# Altium schematic sheet llrf_afe_front_panel.SchDoc
size 209 x 297 mm; SheetNumber: 6; SheetTotal: 17
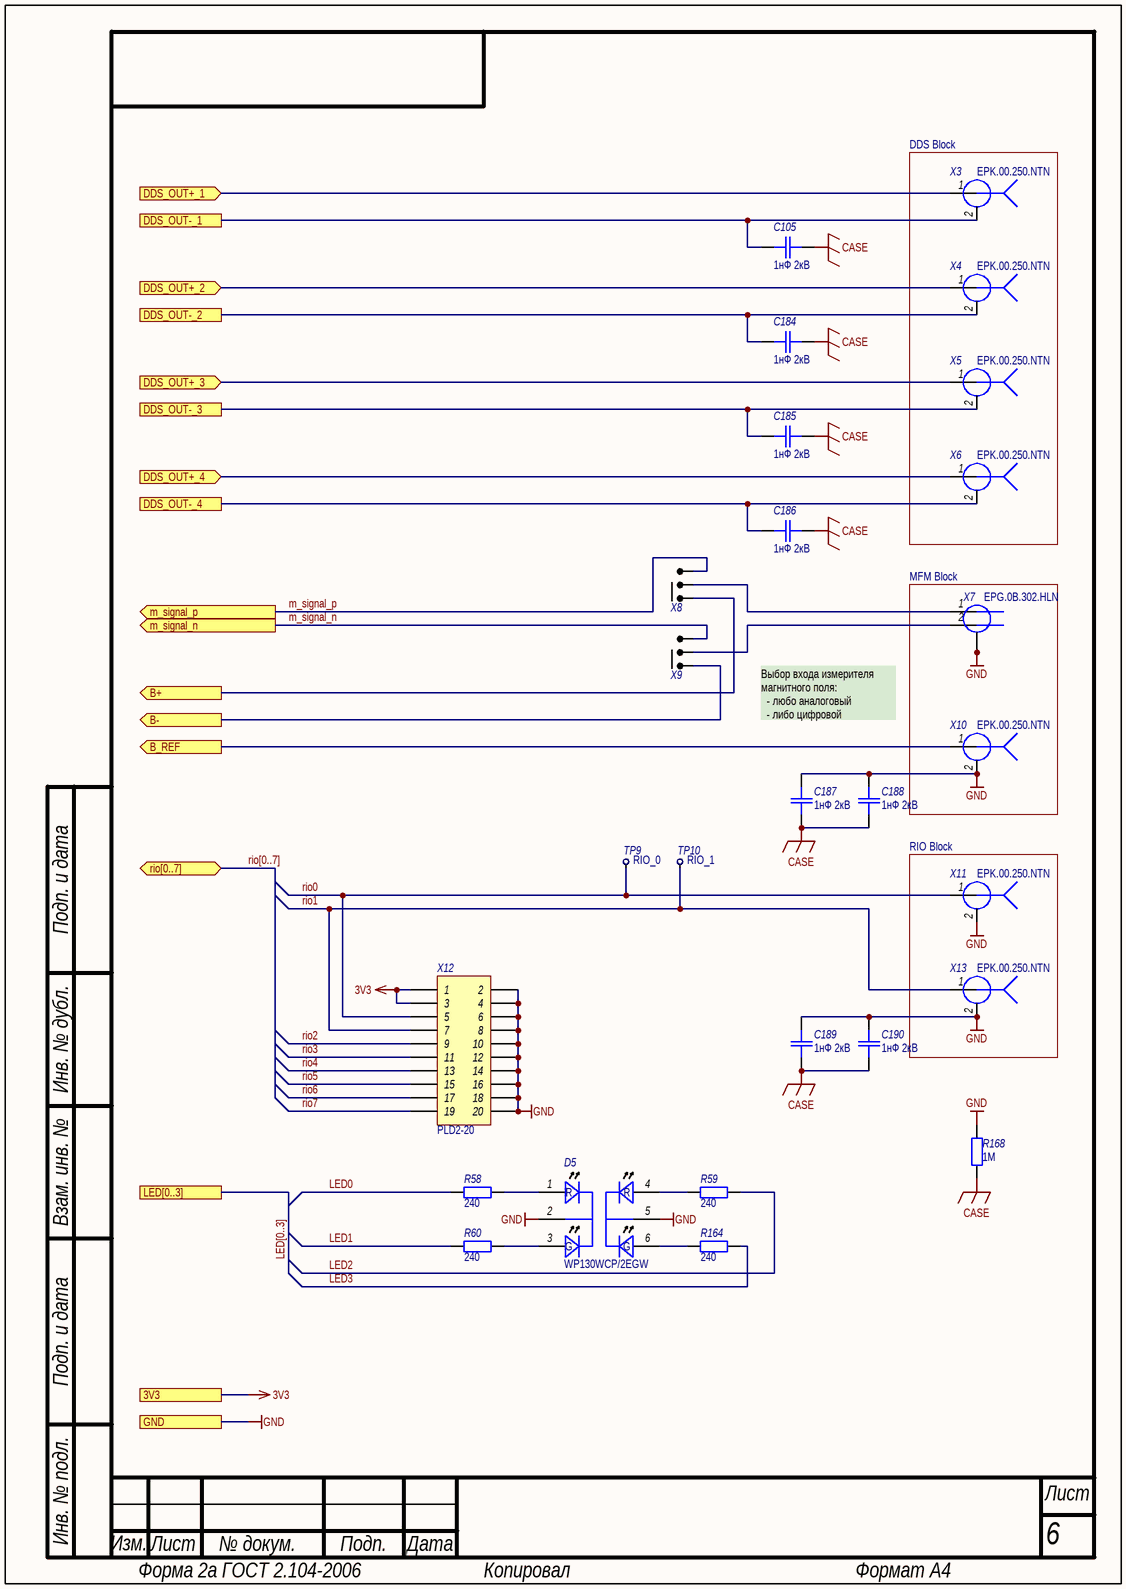
[diagram p0: llrf_afe_front_panel.SchDoc]

## Parts
C105  1нФ 2кВ  [SMD_C1206]
C184  1нФ 2кВ  [SMD_C1206]
C185  1нФ 2кВ  [SMD_C1206]
C186  1нФ 2кВ  [SMD_C1206]
C187  1нФ 2кВ  [SMD_C1206]
C188  1нФ 2кВ  [SMD_C1206]
C189  1нФ 2кВ  [SMD_C1206]
C190  1нФ 2кВ  [SMD_C1206]
D5  WP130WCP/2EGW  [WP130WCP]
R58  240  [SMD_0603]
R59  240  [SMD_0603]
R60  240  [SMD_0603]
R164  240  [SMD_0603]
R168  1M  [SMD_1206]
TP9  RIO_0  [TestPoint]
TP10  RIO_1  [TestPoint]
X3  EPK.00.250.NTN  [EPK.00.250.NTN]
X4  EPK.00.250.NTN  [EPK.00.250.NTN]
X5  EPK.00.250.NTN  [EPK.00.250.NTN]
X6  EPK.00.250.NTN  [EPK.00.250.NTN]
X7  EPG.0B.302.HLN  [EPG.0B.302.HLN]
X8  Jumper 3  [PLS-3]  (value not drawn)
X9  Jumper 3  [PLS-3]  (value not drawn)
X10  EPK.00.250.NTN  [EPK.00.250.NTN]
X11  EPK.00.250.NTN  [EPK.00.250.NTN]
X12  Header 2X20  [PLD2-20]  (value not drawn)
X13  EPK.00.250.NTN  [EPK.00.250.NTN]

## Blocks framed on the sheet
DDS Block: X3-X6
MFM Block: X7 X10
RIO Block: X11 X13

## Ports
3V3, B+ (out), B- (out), B_REF (out), DDS_OUT+_1 (in), DDS_OUT+_2 (in), DDS_OUT+_3 (in), DDS_OUT+_4 (in), DDS_OUT-_1, DDS_OUT-_2, DDS_OUT-_3, DDS_OUT-_4, GND, LED[0..3], m_signal_n (out), m_signal_p (out), rio[0..7] (bidir)

## Nets
3V3: X12.1 X12.3 ; port 3V3
CASE: C105.1 C184.1 C185.1 C186.1 C187.1 C188.1 C189.1 C190.1 R168.2
GND: C187.2 C188.2 C189.2 C190.2 D5.2 D5.5 R168.1 X7.4(GND) X7.5(GND) X7.6(GND) X7.7(GND) X10.2(GND) X11.2(GND) X12.2 X12.4 X12.6 X12.8 X12.10 X12.12 X12.14 X12.16 X12.18 X12.20 X13.2(GND) ; port GND
B+: X8.1 ; port B+
B-: X9.1 ; port B-
B_REF: X10.1(Signal) ; port B_REF
DDS_OUT+_1: X3.1(Signal) ; port DDS_OUT+_1
DDS_OUT+_2: X4.1(Signal) ; port DDS_OUT+_2
DDS_OUT+_3: X5.1(Signal) ; port DDS_OUT+_3
DDS_OUT+_4: X6.1(Signal) ; port DDS_OUT+_4
DDS_OUT-_1: C105.2 X3.2(GND) ; port DDS_OUT-_1
DDS_OUT-_2: C184.2 X4.2(GND) ; port DDS_OUT-_2
DDS_OUT-_3: C185.2 X5.2(GND) ; port DDS_OUT-_3
DDS_OUT-_4: C186.2 X6.2(GND) ; port DDS_OUT-_4
LED0: R58.1
LED1: R60.1
LED2: R59.2
LED3: R164.2
m_signal_n: X9.3 ; port m_signal_n
m_signal_p: X8.3 ; port m_signal_p
rio0: TP9.0(TP) X11.1(Signal) X12.5
rio1: TP10.0(TP) X12.7 X13.1(Signal)
rio2: X12.9
rio3: X12.11
rio4: X12.13
rio5: X12.15
rio6: X12.17
rio7: X12.19
NetD5_1: D5.1 R58.2
NetD5_3: D5.3 R60.2
NetD5_4: D5.4 R59.1
NetD5_6: D5.6 R164.1
NetX7_1: X7.1(Signal_1) X8.2
NetX7_2: X7.2(Signal_2) X9.2

## Buses and harness runs
bus LED[0..3] = port LED[0..3]
bus rio[0..7] = port rio[0..7]

## Notes on the sheet
- Выбор входа измерителя магнитного поля:
  - любо аналоговый
  - либо цифровой
- Подп. и дата
- Инв. № дубл.
- Взам. инв. №
- Инв. № подл.
- Изм.
- Лист
- № докум.
- Подп.
- Дата
- Форма 2а ГОСТ 2.104-2006
- Копировал
- Формат А4
- (in symbol WP130WCP/2EGW) R; G

## Library data of the parts
C105 C184-C190 = Capacitor: Назначение: SMD-конденсатор; Наименование: Конденсатор; Потребление, Вт: 0; Value: 1нФ 2кВ
D5 = WP130WCP/2EGW: 2x Bi-Level Circuit Board Indicator; Потребление, Вт: 0.0; Назначение: Circuit Board Indicator; Наименование: WP130WCP/2EGW; Описание: WP130WCP/2EGW; ComponentLink1Description: DataSheet; ComponentLink1URL: https://www.kingbrightusa.com/images/catalog/SPEC/WP130WCP-2EGW.pdf
R58-R60 R164 = Resistor: Наименование: Резистор; Назначение: SMD-резистор; Потребление, Вт: 0.0; Точность: 1%; Описание: Резистор 240 1%; Value: 240
R168 = Resistor: Наименование: Резистор; Назначение: SMD-резистор; Потребление, Вт: 0,001; Value: 1M
TP9 TP10 = TP: Наименование: Точка проверки; Назначение: Контроль параметров платы
  TP9: TP_Name: RIO_0
  TP10: TP_Name: RIO_1
X3-X6 X10 X11 X13 = EPK.00.250.NTN: LEMO Connector     coax pin EPK.00.250.NTN Elbow receptacle for printed circuit with clearance under the body, Female Contact Drawing Rev. 00 Source: http://www.lemo.com/catalog/ROW/UK_English/00and01Coaxial_en.pdf; Назначение: LEMO Connector, coax 1-pin; ComponentLink1Description: DataSheet; ComponentLink1URL: https://www.lemo.com/pdf/EPK.00.250.NTN.pdf; Потребление, Вт: *; Наименование: EPK.00.250.NTN
X7 = EPG.0B.302.HLN: LEMO Connector    2 pin EPG.0B.302.HLN Elbow receptacle for printed circuit (solder mount), Female Contact Drawing Rev. 00 Source: http://www.lemo.com/catalog/ROW/UK_English/unipole_multipole.pdf; Назначение: LEMO Connector, coax 2-pin; Потребление, Вт: 0.0; ComponentLink1Description: DataSheet; ComponentLink1URL: https://www.lemo.com/pdf/EPY.00.250.NTN.pdf; Наименование: EPG.0B.302.HLN
X8 X9 = Jumper 3: Jumper, 3-Pin, Dual row; Потребление, Вт: 0,0; Наименование: Jumper 3-pin; Назначение: Jumper, 3-Pin, Dual row
X12 = Header 2X20: Header, 20-Pin, Dual row; Потребление, Вт: 0,0; Назначение: Header, 20-Pin, Dual row; Наименование: PLD2-20